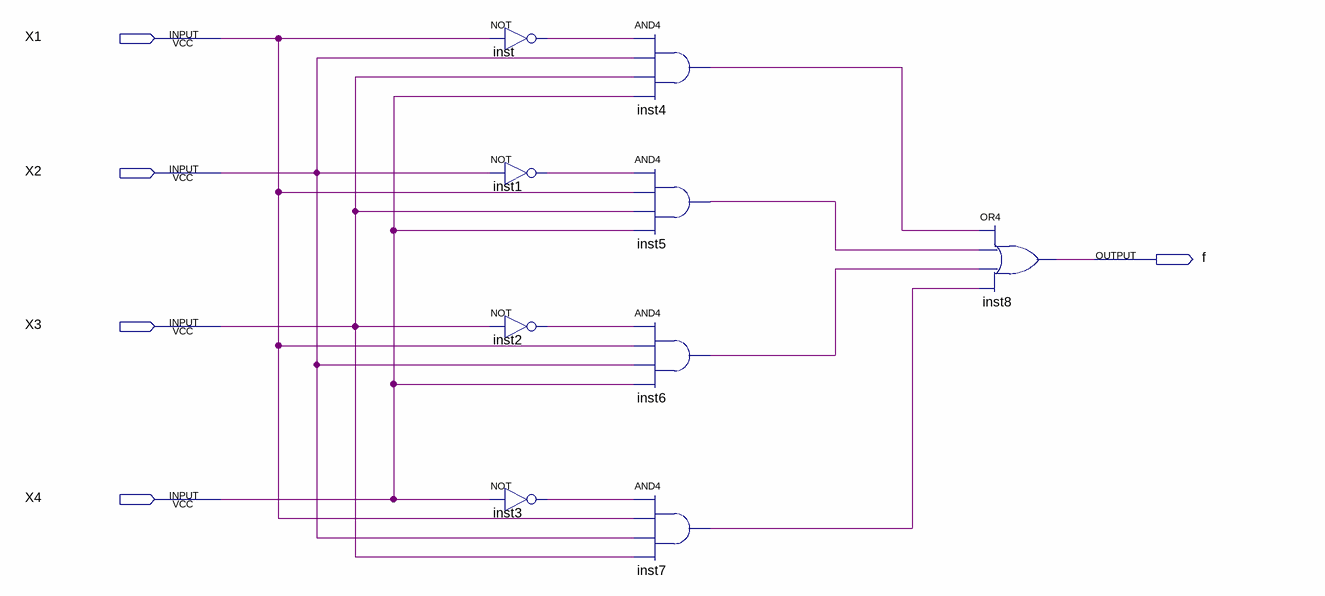
[diagram p0: schematic sheet]
// Quartus schematic PROBLEM_2.bdf as structural Verilog: 9 symbols, 5 pins
module PROBLEM_2 (
  input  X1,
  input  X2,
  input  X3,
  input  X4,
  output f
);

  wire inst1_out, inst2_out, inst3_out, inst4_out, inst5_out, inst6_out, inst7_out, inst_out;

  not inst (inst_out, X1);
  not inst1 (inst1_out, X2);
  not inst2 (inst2_out, X3);
  not inst3 (inst3_out, X4);
  and inst4 (inst4_out, inst_out, X2, X3, X4);
  and inst5 (inst5_out, inst1_out, X1, X3, X4);
  and inst6 (inst6_out, inst2_out, X1, X2, X4);
  and inst7 (inst7_out, inst3_out, X1, X2, X3);
  or inst8 (f, inst4_out, inst5_out, inst6_out, inst7_out);
endmodule
